# EAGLE design latch2 (EAGLE 8.3.1)
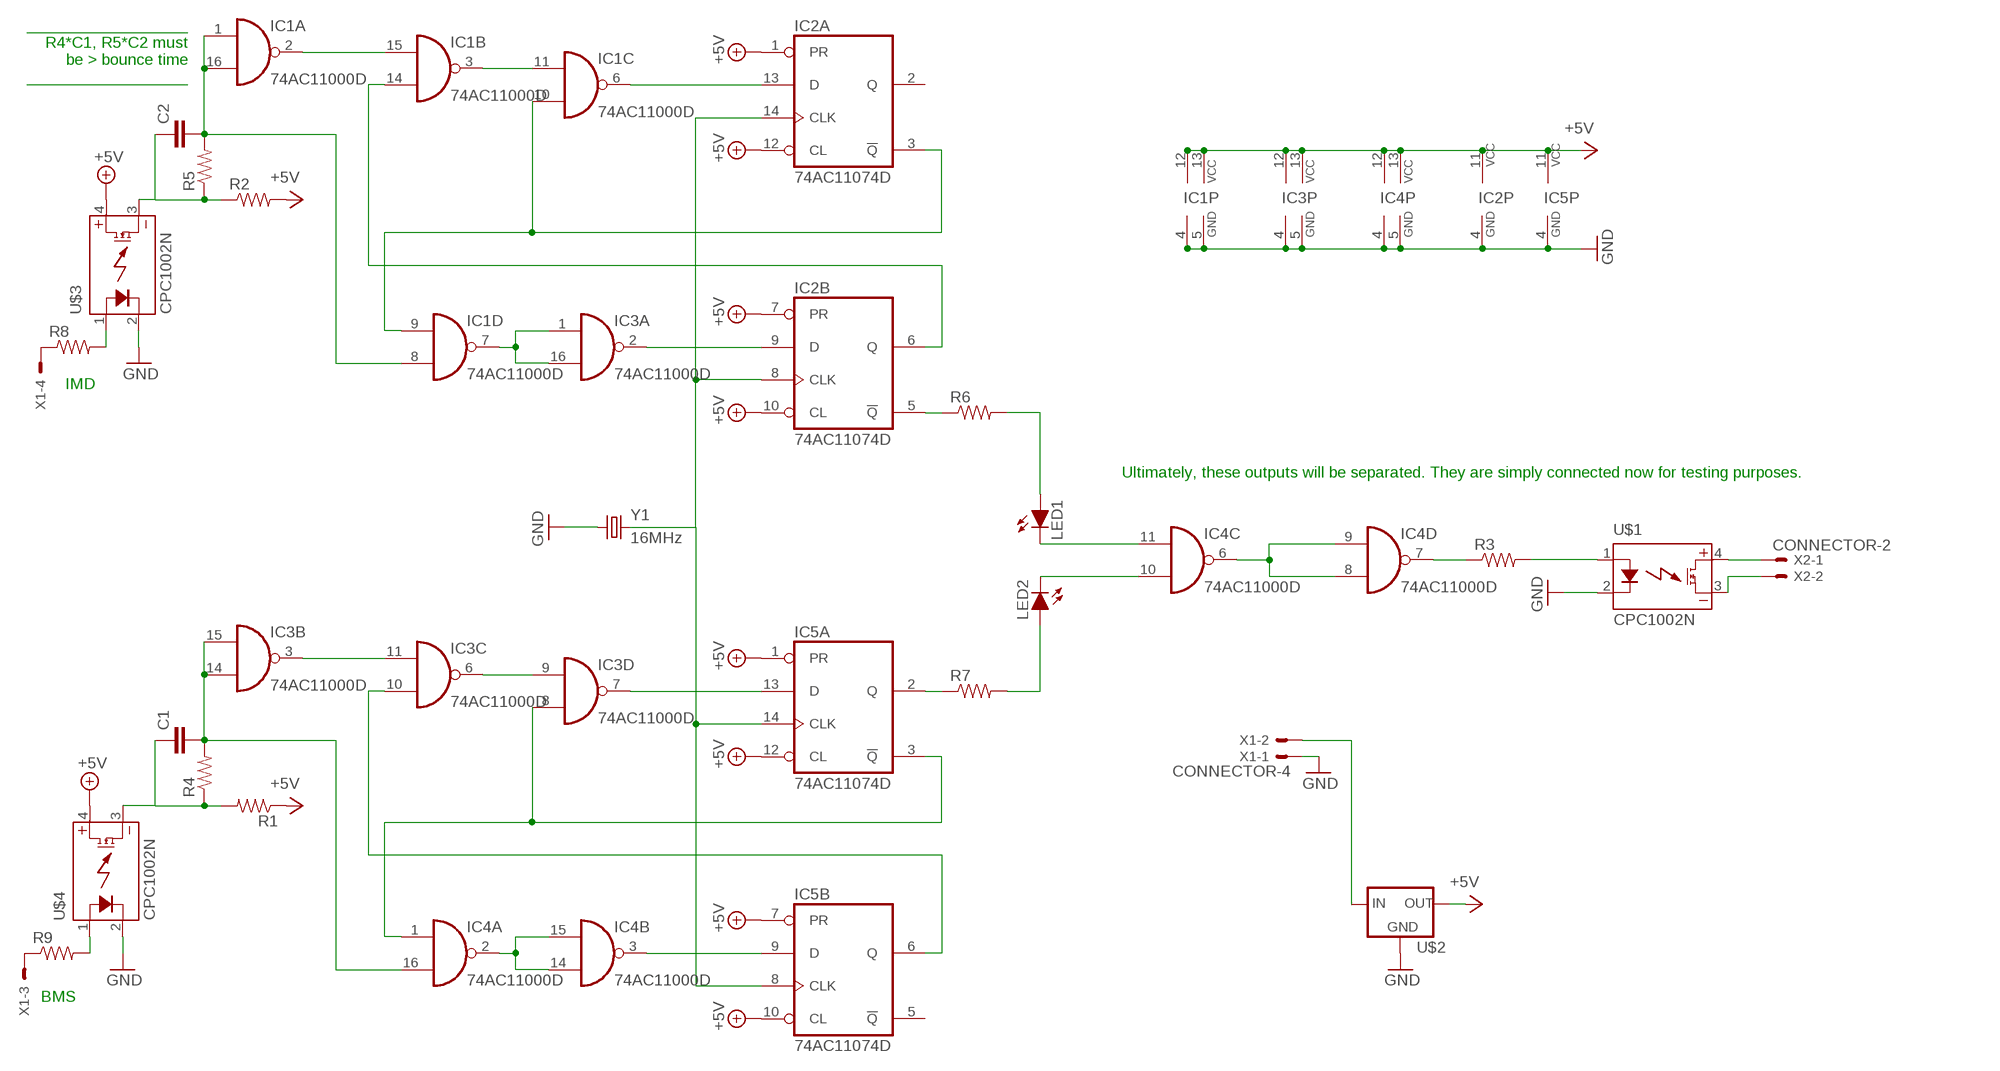
[diagram p0: schematic, sheet 1]

## Parts
C1  CAP0402-CAP  [0402-CAP]
C2  CAP0402-CAP  [0402-CAP]
IC1  74AC11000D  [SO16]
IC2  74AC11074D  [SO14]
IC3  74AC11000D  [SO16]
IC4  74AC11000D  [SO16]
IC5  74AC11074D  [SO14]
LED1  LED-0805  [LED-805]
LED2  LED-0805  [LED-805]
R1  RESISTOR0402  [0402-RES]
R2  RESISTOR0402  [0402-RES]
R3  RESISTOR0402  [0402-RES]
R4  RESISTOR0402  [0402-RES]
R5  RESISTOR0402  [0402-RES]
R6  RESISTOR0402  [0402-RES]
R7  RESISTOR0402  [0402-RES]
R8  RESISTOR0402  [0402-RES]
R9  RESISTOR0402  [0402-RES]
U$1  CPC1002N  [SOP04]
U$2  5VREG_LM340-NLM340MPX-5.0/NOPB  [SOT223]
U$3  CPC1002N  [SOP04]
U$4  CPC1002N  [SOP04]
X1  CONNECTOR-4  [MINIFIT_5566-4]
X2  CONNECTOR-2  [MINIFIT_5566-2]
Y1  16MHz  CRYSTAL3.2X1.5MM  [CRYSTAL-SMD-3.2X1.5MM]

## Nets
+5V: IC1.12(P:VCC) IC1.13(P:VCC) IC2.1(A:PR) IC2.7(B:PR) IC2.10(B:CL) IC2.11(P:VCC) IC2.12(A:CL) IC3.12(P:VCC) IC3.13(P:VCC) IC4.12(P:VCC) IC4.13(P:VCC) IC5.1(A:PR) IC5.7(B:PR) IC5.10(B:CL) IC5.11(P:VCC) IC5.12(A:CL) R1.1 R2.2 U$2.3(OUT) U$3.4(DC+) U$4.4(DC+)
GND: IC1.4(P:GND) IC1.5(P:GND) IC2.4(P:GND) IC3.4(P:GND) IC3.5(P:GND) IC4.4(P:GND) IC4.5(P:GND) IC5.4(P:GND) U$1.2(CONTROL-) U$2.2(GND) U$2.4(GND) U$3.2(CONTROL-) U$4.2(CONTROL-) X1.1 Y1.P$1
N$1: C2.1 R2.1 R5.1 U$3.3(DC-)
N$2: IC1.2(A:O) IC1.15(B:I0)
N$3: C2.2 IC1.1(A:I0) IC1.8(D:I1) IC1.16(A:I1) R5.2
N$4: IC1.3(B:O) IC1.11(C:I0)
N$5: IC1.9(D:I0) IC1.10(C:I1) IC2.3(A:!Q)
N$6: IC1.6(C:O) IC2.13(A:D)
N$7: IC2.8(B:CLK) IC2.14(A:CLK) IC5.8(B:CLK) IC5.14(A:CLK) Y1.P$2
N$8: IC2.9(B:D) IC3.2(A:O)
N$9: IC1.14(B:I1) IC2.6(B:Q)
N$10: IC4.3(B:O) IC5.9(B:D)
N$11: IC1.7(D:O) IC3.1(A:I0) IC3.16(A:I1)
N$12: IC4.7(D:O) R3.1
N$13: R3.2 U$1.1(CONTROL+)
N$14: C1.2 IC3.14(B:I1) IC3.15(B:I0) R4.2
N$15: C1.1 R1.2 R4.1 U$4.3(DC-)
N$16: U$2.1(IN) X1.2
N$17: U$1.4(DC+) X2.1
N$18: U$1.3(DC-) X2.2
N$19: IC4.16(A:I1)
N$20: IC3.3(B:O) IC3.11(C:I0)
N$21: IC3.6(C:O) IC3.9(D:I0)
N$22: IC3.8(D:I1) IC4.1(A:I0) IC5.3(A:!Q)
N$23: IC3.7(D:O) IC5.13(A:D)
N$24: IC3.10(C:I1) IC5.6(B:Q)
N$25: IC4.2(A:O) IC4.14(B:I1) IC4.15(B:I0)
N$26: LED2.A R7.2
N$27: IC4.6(C:O) IC4.8(D:I1) IC4.9(D:I0)
N$28: LED1.A R6.2
N$29: IC2.5(B:!Q) R6.1
N$30: IC5.2(A:Q) R7.1
N$31: R8.2 U$3.1(CONTROL+)
N$32: R8.1 X1.4
N$33: R9.1 X1.3
N$34: R9.2 U$4.1(CONTROL+)
N$35: IC4.11(C:I0) LED1.C
N$36: IC4.10(C:I1) LED2.C
Unconnected: IC2.2(A:Q) IC5.5(B:!Q)

## Notes on the sheet
- _________________
  R4*C1, R5*C2 must
  be > bounce time
  _________________
- IMD
- Ultimately, these outputs will be separated. They are simply connected now for testing purposes.
- BMS

## Library data of the parts
C1 C2 = HyTechDevices:CAP: Capacitor Standard 0603 ceramic capacitor, and 0.1" leaded capacitor.
IC1 IC3 IC4 = 74ac-logic:74AC11000: Quadruple 2-input NAND
IC2 IC5 = 74ac-logic:74AC11074: Dual positive edge triggered D-type FLIP FLOP
LED1 LED2 = HyTechDevices:LED: Light Emitting Diode (LED) Source: Dangerous Prototypes Eagle Library <https://github.com/DangerousPrototypes/Eagle_Part_Library>
R1-R9 = HyTechDevices:RESISTOR: Resistor Basic schematic elements and footprints for 0603, 1206, and PTH resistors.
U$1 U$3 U$4 = HyTechDevices:CPC1002N: IXYS Solid State Relay .7A
U$2 = HyTechDevices:5VREG_LM340-N: Voltage Regulator 5v linear voltage regulator Datasheet <http://www.mouser.com/ProductDetail/Texas-Instruments/LM340MPX-50-NOPB/?qs=X1J7HmVL2ZGZwtTFRQ9ItA%3D%3D> MAX current out: 1.5A MAX voltage in: 35V
X1 = HyTechDevices:CONNECTOR-4: Mini-Fit Junior connector 4 pole Source: http://www.molex.com; OC_FARNELL: unknown; OC_NEWARK: unknown
X2 = HyTechDevices:CONNECTOR-2: Mini-Fit Junior connector 2 pole Source: http://www.molex.com; OC_FARNELL: 1822072; OC_NEWARK: unknown
Y1 = HyTechDevices:CRYSTAL: Various standard crystals. Proven footprints. Source: Sparkfun <https://github.com/sparkfun/SparkFun-Eagle-Libraries>; PROD_ID: XTAL-13062; VALUE: 32.768kHz

## Board
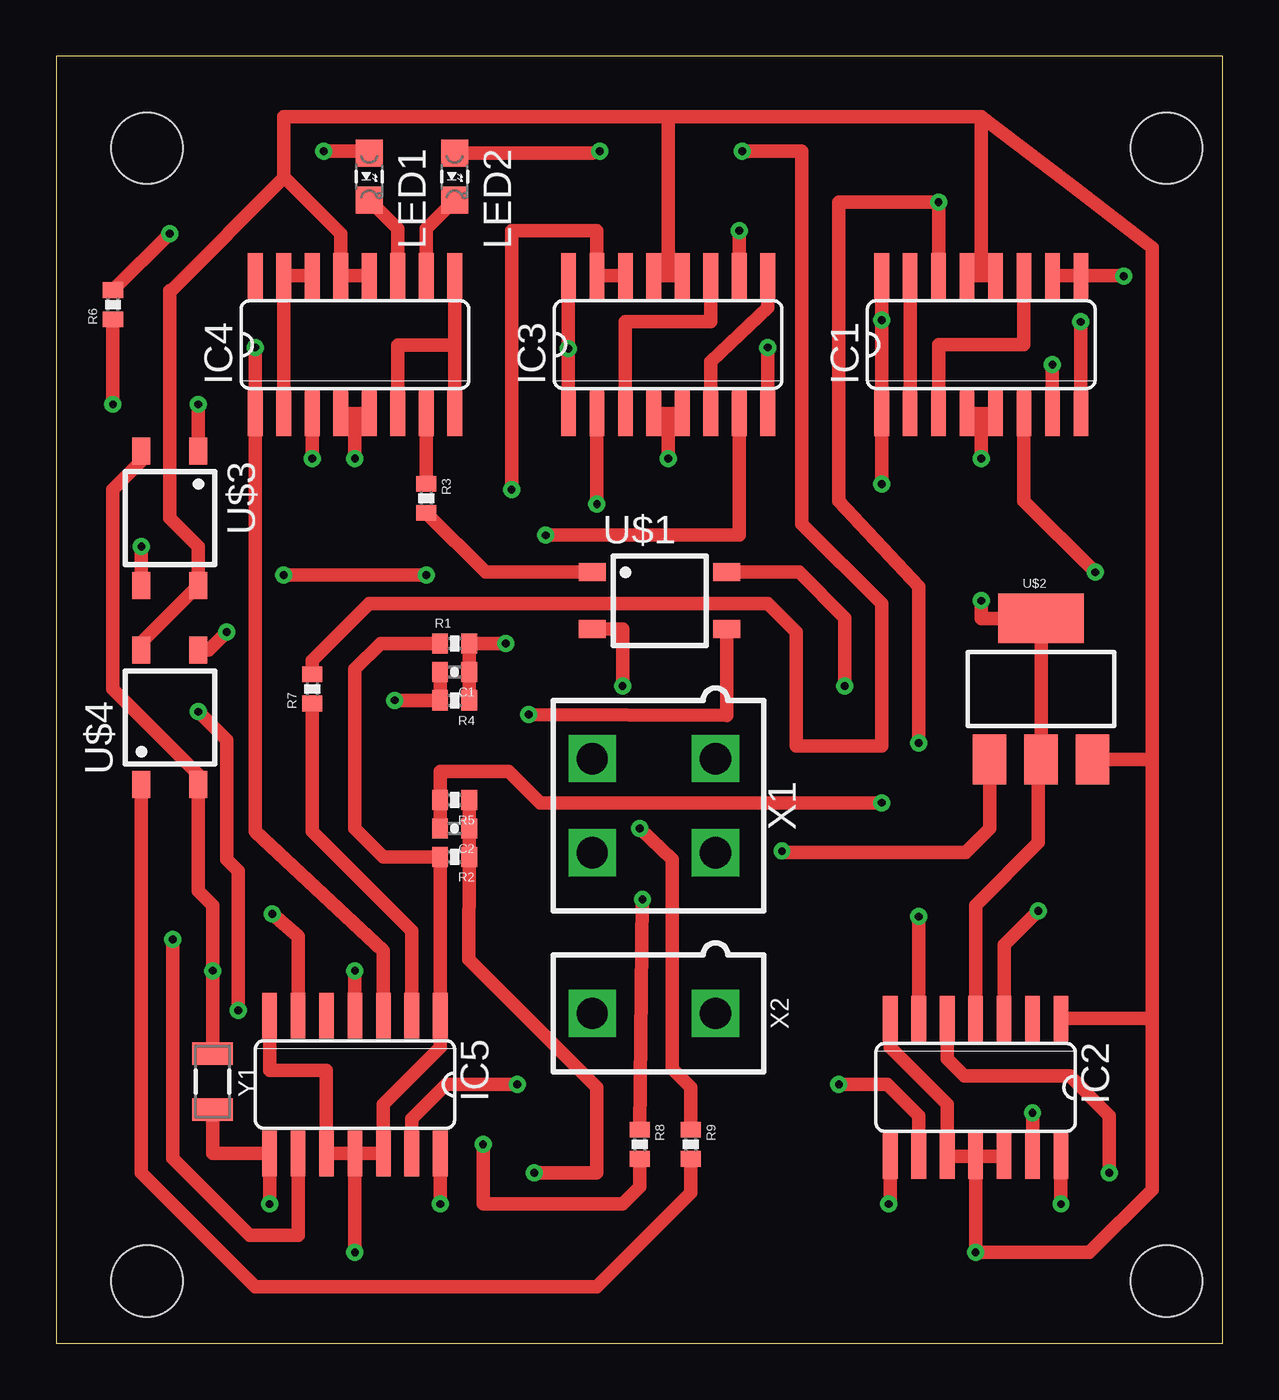
[diagram p1: board, top side]
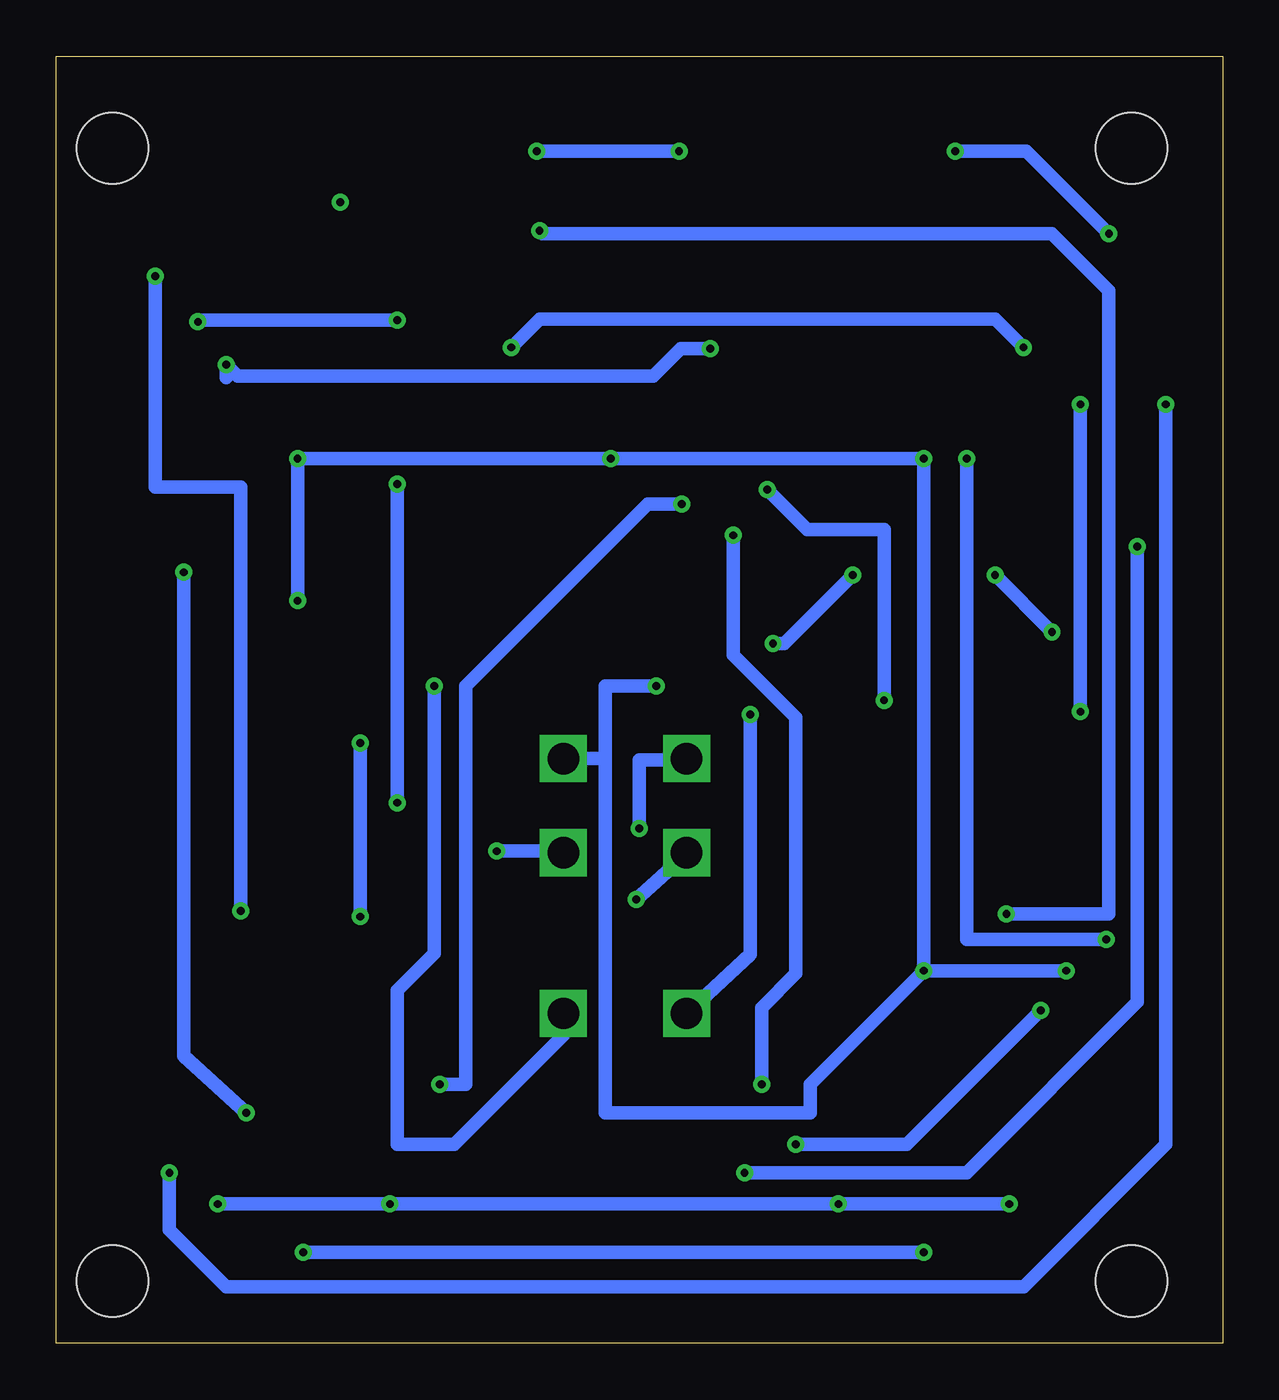
[diagram p2: board, bottom side, seen from below]

Size 52.05 x 57.45 mm. Coordinates in mm from the lower left corner, seen from the top.
Outline: 0,0 52.05,0 52.05,57.45 0,57.45 0,0
Copper layers (1*16): Top 0.035mm / dielectric 1.5mm / Bottom 0.035mm
Design rules "default *": minimum track width 6mil, minimum drill 0.35mm, track to track 16mil, track to pad 16mil, pad to pad 16mil, via to via 16mil, smd to smd 16mil, copper to edge 40mil, drill to drill 6mil, minimum pad ring 10mil, minimum via ring 8mil, stop-mask expansion 4mil, vias tented up to drill 0mil, thermal gap 10mil
Holes 3.17 mm at 4.06,2.79 4.06,53.34 49.53,53.34 49.53,2.79

### Footprints (pad centres in the part's own frame; a part is rotated, then mirrored left to right if it is on the bottom)
0402-CAP = smd 0.7 x 0.9: 1 -0.65,0; 2 0.65,0
SO16 = smd 0.66 x 2.032: 1 -4.445,-3.073; 2 -3.175,-3.073; 3 -1.905,-3.073; 4 -0.635,-3.073; 5 0.635,-3.073; 6 1.905,-3.073; 7 3.175,-3.073; 8 4.445,-3.073; 9 4.445,3.073; 10 3.175,3.073; 11 1.905,3.073; 12 0.635,3.073; 13 -0.635,3.073; 14 -1.905,3.073; 15 -3.175,3.073; 16 -4.445,3.073
SO14 = smd 0.66 x 2.032: 1 -3.81,-3.073; 2 -2.54,-3.073; 3 -1.27,-3.073; 4 0,-3.073; 5 1.27,-3.073; 6 2.54,-3.073; 7 3.81,-3.073; 8 3.81,3.073; 9 2.54,3.073; 10 1.27,3.073; 11 0,3.073; 12 -1.27,3.073; 13 -2.54,3.073; 14 -3.81,3.073
LED-805 = smd 1.2 x 1.2: A 0,-1.05; C 0,1.05
0402-RES = smd 0.7 x 0.9: 1 -0.65,0; 2 0.65,0
SOP04 = smd 0.8 x 1.2: 1 -1.27,-3; 2 1.27,-3; 3 1.27,3; 4 -1.27,3
SOT223 = smd 1.5 x 2.235: 1 -2.3,-3.15; 2 0,-3.15; 3 2.3,-3.15 | smd 3.8 x 2.2: 4 0,3.15
MINIFIT_5566-4 = drill 1.4 square: 1 2.1,-2.75; 2 -2.1,-2.75; 3 2.1,2.75; 4 -2.1,2.75
MINIFIT_5566-2 = drill 1.4 square: 1 0,-2.75; 2 0,2.75
CRYSTAL-SMD-3.2X1.5MM = smd 1 x 1.8: P$1 -1.25,0; P$2 1.25,0

### Placement (x,y rotation side)
C1  17.78,29.97 180 top
C2  17.78,22.99 180 top
IC1  41.28,44.58 0 top
IC2  41.02,11.43 180 top
IC3  27.3,44.58 0 top
IC4  13.33,44.58 0 top
IC5  13.33,11.56 180 top
LED1  13.97,52.07 180 top
LED2  17.78,52.07 180 top
R1  17.78,31.24 0 top
R2  17.78,21.72 180 top
R3  16.51,37.72 270 top
R4  17.78,28.7 180 top
R5  17.78,24.26 180 top
R6  2.54,46.35 90 top
R7  11.43,29.21 90 top
R8  26.04,8.89 270 top
R9  28.32,8.89 270 top
U$1  26.92,33.15 270 top
U$2  43.94,29.21 0 top
U$3  5.08,36.83 180 top
U$4  5.08,27.94 0 top
X1  26.67,24 90 top
X2  26.67,14.73 90 top
Y1  6.98,11.68 270 top

### Tracks (layer width: path | path; a pad name or v marks a point on that pad's centre or on a via)
+5V  (via drill 0.35)
  Top 0.61: 12.86,47.65 IC4.12 | IC3.13 27.3,47.65 | IC1.13 41.28,47.65 | IC5.11 IC5.10 12.06,12.19 9.53,12.19 IC5.7 | IC5.11 IC5.12 14.61,10.67 17.14,13.21 IC5.1 17.14,21.72 R2.2 14.61,21.72 13.33,22.99 13.33,30.1 14.48,31.24 R1.1 | IC2.11 IC2.12 | IC4.13 12.86,47.65 | 27.3,47.65 27.3,54.74 | 41.28,54.74 41.28,47.65 | 27.3,54.74 41.28,54.74 | IC2.11 v41.02,4.06 46.1,4.06 48.9,6.86 48.9,14.5 | 41.28,47.65 IC1.12 | 48.9,14.5 48.9,26.06 | 48.9,26.06 48.9,48.9 45.47,51.56 41.28,54.74 | U$2.3 48.9,26.06 | IC2.1 48.9,14.5 | 27.3,47.65 IC3.12 | IC2.11 IC2.10 39.75,10.67 37.21,13.21 IC2.7 | 10.19,52.04 10.16,52.07 10.16,54.74 27.3,54.74 | 10.19,52.04 12.7,49.53 12.7,47.81 12.86,47.65 | U$4.4 3.81,31.29 U$3.4 6.35,35.56 5.08,36.83 5.08,46.99 5.13,46.99 10.19,52.04 | IC5.11 v13.33,4.06
  Bottom 0.61: v41.02,4.06 v13.33,4.06
GND  (via drill 0.35)
  Top 0.61: IC1.4 41.28,41.5 | 41.28,41.5 IC1.5 | IC3.5 27.3,41.5 | 27.3,41.5 IC3.4 | IC4.5 13.33,41.5 | IC4.4 13.33,41.5 | 13.33,41.5 v13.33,39.5 | v27.3,39.5 27.3,41.5 | 41.28,41.5 v41.28,39.5 | IC5.4 v13.33,16.64 | v41.28,33.15 41.28,32.36 U$2.4 U$2.2 43.94,26.32 43.82,26.32 43.82,22.35 41.02,19.56 IC2.4 | Y1.P$1 v6.98,16.64 6.98,19.56 6.35,20.19 U$4.2 6.35,25.4 2.54,29.21 2.54,38.1 3.81,39.37 U$3.2 | v25.27,29.34 25.27,31.88 U$1.2
  Bottom 0.61: v13.33,16.64 v13.33,39.5 v27.3,39.5 v41.28,39.5 v41.28,33.15 | v6.98,16.64 v13.33,16.64 | 27.56,26.16 27.62,26.1 X1.1 | 27.56,26.16 27.56,29.34 v25.27,29.34 | v13.33,16.64 18.41,11.56 18.41,10.29 27.56,10.29 27.56,26.16
N$1  (via drill 0.35)
  Top 0.61: R5.1 C2.1 R2.1 18.41,17.14 24.13,11.43 24.13,7.62 v21.34,7.62 | v3.81,35.56 U$3.3
  Bottom 0.61: v21.34,7.62 11.43,7.62 3.81,15.24 v3.81,35.56
N$2
  Top 0.61: IC1.15 IC1.2
N$3  (via drill 0.35)
  Top 0.61: IC1.16 v36.83,45.67 IC1.1 v36.83,38.35 | IC1.8 v45.72,45.59 | C2.2 R5.2 17.13,25.53 20.19,25.53 21.59,24.13 v36.83,24.13
  Bottom 0.61: v45.72,45.59 45.72,45.67 v36.83,45.67 | v36.83,38.35 v36.83,24.13
N$4
  Top 0.61: IC1.3 39.37,44.58 43.18,44.58 IC1.11
N$5  (via drill 0.35)
  Top 0.61: IC1.10 IC1.9 47.62,47.65 v47.62,47.62 | IC2.3 42.29,17.78 v43.82,19.3
  Bottom 0.61: v43.82,19.3 43.82,38.23 47.62,38.23 v47.62,47.62
N$6  (via drill 0.35)
  Top 0.61: IC1.6 43.18,37.59 v46.36,34.42 | v43.56,10.29 IC2.13
  Bottom 0.61: v46.36,34.42 46.36,12.83 v43.56,10.29
N$7  (via drill 0.35)
  Top 0.61: Y1.P$2 6.98,8.48 IC5.8 v9.53,6.22 | v17.14,6.22 IC5.14 | v44.83,6.22 IC2.14 | IC2.8 37.21,6.22 v37.15,6.22
  Bottom 0.61: v9.53,6.22 v17.14,6.22 v37.15,6.22 v44.83,6.22
N$8  (via drill 0.35)
  Top 0.61: IC3.2 v24.13,37.47 | v34.93,11.56 37.08,11.56 38.48,10.16 IC2.9
  Bottom 0.61: v34.93,11.56 33.78,11.56 33.78,29.34 25.65,37.47 v24.13,37.47
N$9  (via drill 0.35)
  Top 0.61: IC1.14 v39.37,50.93 34.93,50.93 34.93,37.59 38.48,33.78 v38.48,26.8 | IC2.6 v38.48,19.05
  Bottom 0.61: v38.48,26.8 v38.48,19.05
N$10  (via drill 0.35)
  Top 0.61: IC5.9 10.79,4.83 8.64,4.83 5.21,8.26 v5.21,18.03 | IC4.3 v11.43,39.5
  Bottom 0.61: v5.21,18.03 11.43,18.03 v11.43,39.5
N$11  (via drill 0.35)
  Top 0.61: IC3.16 v22.86,44.4 IC3.1 | v44.45,43.69 IC1.7
  Bottom 0.61: 44.45,43.1 v44.45,43.69 43.94,43.18 25.4,43.18 24.18,44.4 v22.86,44.4
N$12
  Top 0.61: IC4.7 R3.1
N$13
  Top 0.61: U$1.1 19.16,34.42 R3.2
N$14  (via drill 0.35)
  Top 0.61: IC3.14 IC3.15 24.13,49.66 20.32,49.66 v20.32,38.1 | C1.2 R4.2 v15.11,28.7
  Bottom 0.61: v15.11,28.7 15.11,36.32 18.54,36.32 v20.32,38.1
N$15  (via drill 0.35)
  Top 0.61: R4.1 C1.1 R1.2 v20.07,31.24 | U$4.3 6.81,30.94 v7.62,31.75 | v16.51,34.29 v10.16,34.29
  Bottom 0.61: v7.62,31.75 v10.16,34.29 | v20.07,31.24 19.56,31.24 v16.51,34.29
N$16  (via drill 0.35)
  Top 0.61: U$2.1 41.66,26.05 41.66,22.99 40.57,21.9 32.38,21.9 v32.38,21.97
  Bottom 0.61: X1.2 29.42,21.97 v32.38,21.97
N$17  (via drill 0.35)
  Top 0.61: U$1.4 33.15,34.42 35.18,32.38 v35.18,29.34
  Bottom 0.61: v35.18,29.34 35.18,17.4 36.83,15.75 36.83,8.89 34.29,8.89 29.42,13.76 X2.1
N$18  (via drill 0.35)
  Top 0.61: U$1.3 29.92,28.02 v21.08,28.07
  Bottom 0.61: v21.08,28.07 21.08,17.36 X2.2
N$20
  Top 0.61: IC3.3 25.4,45.59 29.21,45.59 IC3.11
N$21
  Top 0.61: IC3.6 29.21,43.81 31.75,46.23 IC3.9
N$22  (via drill 0.35)
  Top 0.61: v8.89,44.45 IC4.1 8.89,22.86 14.61,17.53 IC5.3 | v31.75,44.45 IC3.8
  Bottom 0.61: v8.89,44.45 10.16,45.72 30.48,45.72 v31.75,44.45
N$23  (via drill 0.35)
  Top 0.61: IC5.13 15.88,10.03 17.4,11.56 v20.57,11.56 | IC3.7 30.48,36.07 v21.84,36.07
  Bottom 0.61: v21.84,36.07 21.84,30.73 19.05,27.94 19.05,16.51 20.57,14.99 v20.57,11.56
N$24  (via drill 0.35)
  Top 0.61: v30.48,49.66 IC3.10 | IC5.6 10.79,18.16 v9.65,19.18
  Bottom 0.61: v9.65,19.18 5.08,19.18 5.08,46.99 7.62,49.53 30.35,49.53 v30.48,49.66
N$25
  Top 0.61: IC4.14 IC4.15 IC4.2
N$26  (via drill 0.35)
  Top 0.61: R7.2 11.43,30.48 13.97,33.02 31.75,33.02 33.02,31.75 33.02,26.67 36.83,26.67 36.83,33.02 33.27,36.58 33.27,53.21 v30.61,53.21 | v24.26,53.21 23.91,53.12 LED2.A
  Bottom 0.61: v30.61,53.21 v24.26,53.21
N$27
  Top 0.61: 17.78,44.56 IC4.9 | 17.78,44.56 IC4.8 | IC4.6 15.24,44.56 17.78,44.56
N$28  (via drill 0.35)
  Top 0.61: LED1.A 13.97,53.21 v11.94,53.21 | R6.2 v5.08,49.53
  Bottom 0.61: v11.94,53.21 8.76,53.21 v5.08,49.53
N$29  (via drill 0.35)
  Top 0.61: IC2.5 39.75,12.7 40.51,11.94 45.21,11.94 46.99,10.16 v46.99,7.62 | v2.54,41.91 R6.1
  Bottom 0.61: v46.99,7.62 46.99,5.08 44.45,2.54 8.89,2.54 2.54,8.89 v2.54,41.91
N$30
  Top 0.61: R7.1 11.43,22.86 15.88,18.41 IC5.2
N$31  (via drill 0.35)
  Top 0.61: R8.2 26.04,6.99 25.27,6.22 19.05,6.22 v19.05,8.89 | v8.13,14.86 8.13,21.08 7.62,21.59 7.62,26.92 v6.35,28.19 | v6.35,41.91 U$3.1
  Bottom 0.61: v19.05,8.89 14.1,8.89 v8.13,14.86 | v6.35,28.19 v6.35,41.91
N$32  (via drill 0.35)
  Top 0.61: R8.1 v26.16,19.81
  Bottom 0.61: v26.16,19.81 23.92,21.84 X1.4
N$33  (via drill 0.35)
  Top 0.61: R9.1 28.32,11.43 27.5,12.26 27.5,21.59 v26.04,22.99
  Bottom 0.61: X1.3 23.99,26.04 26.04,26.04 v26.04,22.99
N$34
  Top 0.61: R9.2 28.32,6.73 24.13,2.54 8.89,2.54 3.81,7.62 U$4.1
N$35
  Top 0.61: IC4.11 15.24,49.75 LED1.C
N$36
  Top 0.61: IC4.10 16.51,49.75 LED2.C